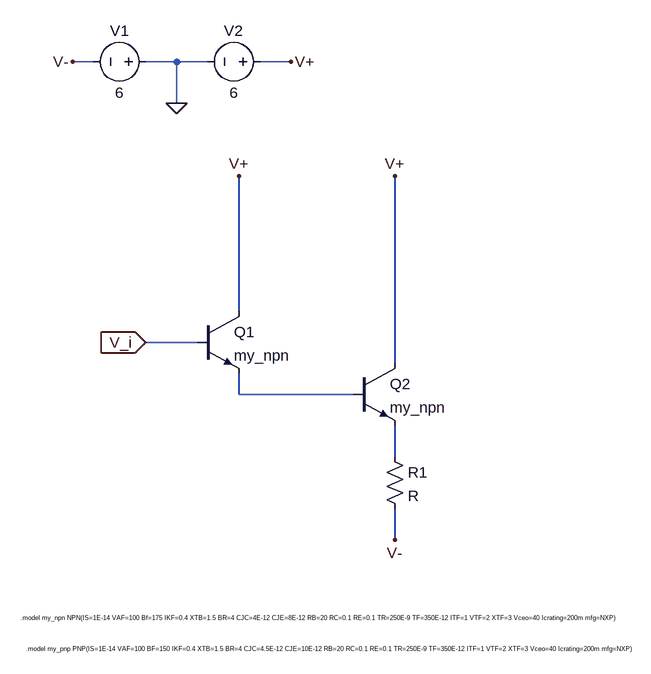
[diagram p0: schematic emitter_follower copy 2.asc]
emitter_follower copy 2.asc, the LTspice schematic file:
Version 4
SHEET 1 2800 768
WIRE -64 -144 -96 -144
WIRE 64 -144 16 -144
WIRE 112 -144 64 -144
WIRE 240 -144 192 -144
WIRE 64 -80 64 -144
WIRE 160 240 160 32
WIRE 96 288 16 288
WIRE 400 320 400 32
WIRE 160 368 160 336
WIRE 336 368 160 368
WIRE 400 464 400 416
WIRE 400 592 400 544
FLAG 240 -144 V+
FLAG -96 -144 V-
FLAG 64 -80 0
FLAG 160 32 V+
FLAG 400 592 V-
FLAG 16 288 V_i
IOPIN 16 288 In
FLAG 400 32 V+
SYMBOL Voltage 32 -144 R90
WINDOW 0 -32 56 VBottom 2
WINDOW 3 32 56 VTop 2
SYMATTR InstName V1
SYMATTR Value 6
SYMBOL Voltage 208 -144 R90
WINDOW 0 -32 56 VBottom 2
WINDOW 3 32 56 VTop 2
SYMATTR InstName V2
SYMATTR Value 6
SYMBOL npn 96 240 R0
SYMATTR InstName Q1
SYMATTR Value my_npn
SYMBOL npn 336 320 R0
SYMATTR InstName Q2
SYMATTR Value my_npn
SYMBOL Res 384 448 R0
SYMATTR InstName R1
TEXT -176 712 Left 0 !.model my_npn NPN(IS=1E-14 VAF=100 Bf=175 IKF=0.4 XTB=1.5 BR=4 CJC=4E-12 CJE=8E-12 RB=20 RC=0.1 RE=0.1 TR=250E-9 TF=350E-12 ITF=1 VTF=2 XTF=3 Vceo=40 Icrating=200m mfg=NXP)
TEXT -168 760 Left 0 !.model my_pnp PNP(IS=1E-14 VAF=100 BF=150 IKF=0.4 XTB=1.5 BR=4 CJC=4.5E-12 CJE=10E-12 RB=20 RC=0.1 RE=0.1 TR=250E-9 TF=350E-12 ITF=1 VTF=2 XTF=3 Vceo=40 Icrating=200m mfg=NXP)

The netlist it stands for:
* emitter_follower copy 2.asc
V1 0 V- 6
V2 V+ 0 6
Q1 V+ V_i N001 0 my_npn
Q2 V+ N001 N002 0 my_npn
R1 N002 V- R
.model NPN NPN
.model PNP PNP
.lib standard.bjt
.model my_npn NPN(IS=1E-14 VAF=100 Bf=175 IKF=0.4 XTB=1.5 BR=4 CJC=4E-12 CJE=8E-12 RB=20 RC=0.1 RE=0.1 TR=250E-9 TF=350E-12 ITF=1 VTF=2 XTF=3 Vceo=40 Icrating=200m mfg=NXP)
.model my_pnp PNP(IS=1E-14 VAF=100 BF=150 IKF=0.4 XTB=1.5 BR=4 CJC=4.5E-12 CJE=10E-12 RB=20 RC=0.1 RE=0.1 TR=250E-9 TF=350E-12 ITF=1 VTF=2 XTF=3 Vceo=40 Icrating=200m mfg=NXP)
.backanno
.end